# Altium schematic sheet Ethernet_Jack.SchDoc: Ethernet Jack
size A; Revision: 1
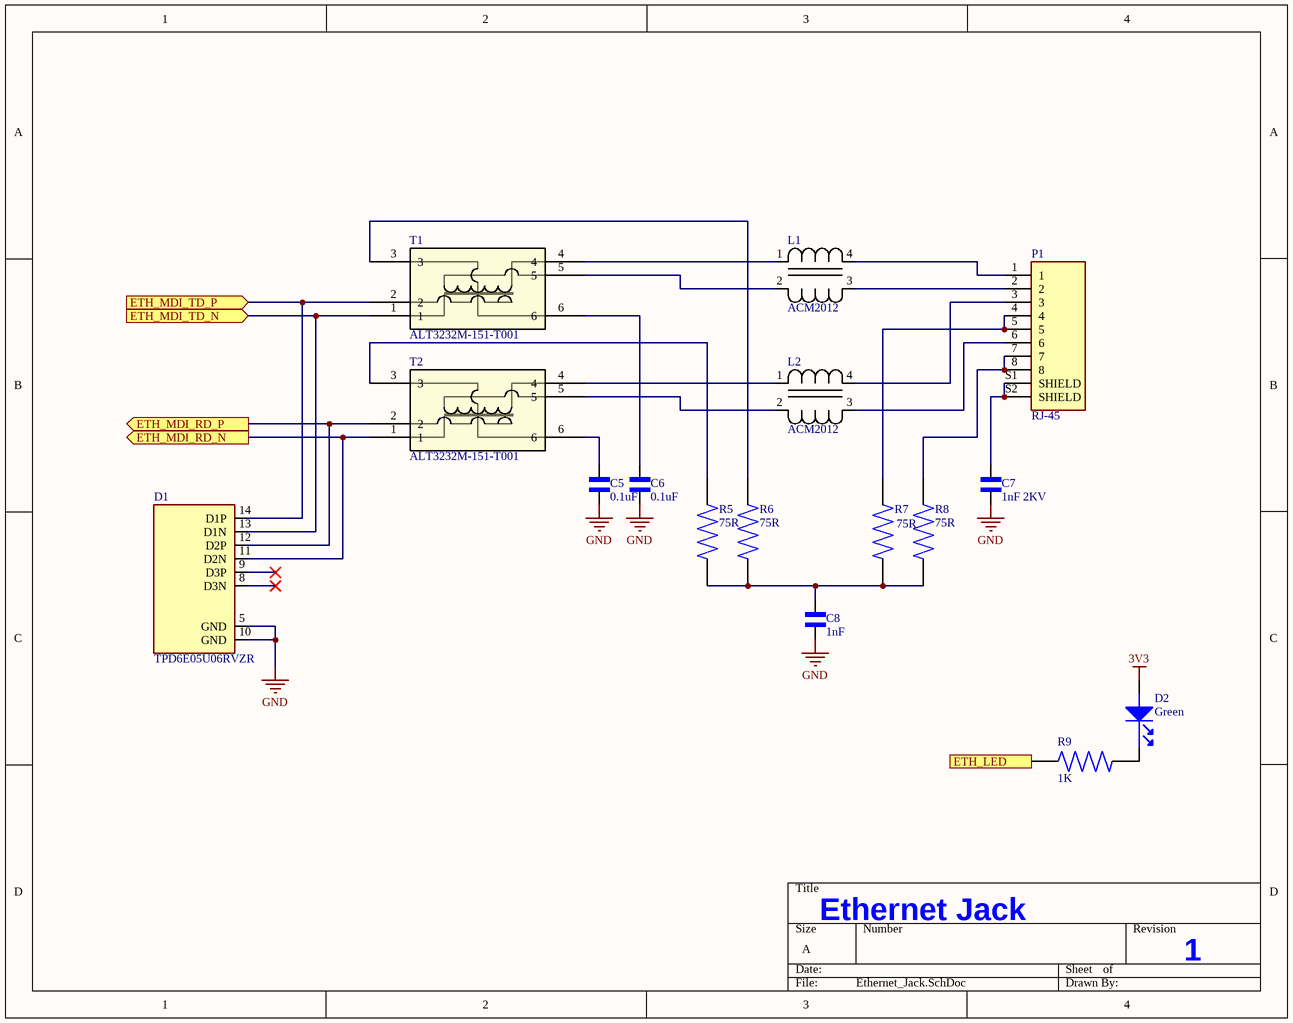
[diagram p0: Ethernet_Jack.SchDoc]

## Parts
C5  0.1uF  [C0402]
C6  0.1uF  [C0402]
C7  1nF 2KV  [RESC1206X70N]
C8  1nF  [C0402]
D1  TPD6E05U06RVZR  [SON50P135X350X55-14N]
D2  Green  [LED_0603]
L1  ACM2012  [IND_TDK_ACM2012_2P_TDK-M]
L2  ACM2012  [IND_TDK_ACM2012_2P_TDK-M]
P1  RJ-45  [TE_1-406541-5]
R5  75R  [R0402 Vishay]
R6  75R  [R0402 Vishay]
R7  75R  [R0402 Vishay]
R8  75R  [R0402 Vishay]
R9  1K  [R0603 Vishay]
T1  ALT3232M-151-T001  [ALT3232M-151-T001]
T2  ALT3232M-151-T001  [ALT3232M-151-T001]

## Ports
ETH_LED (in), ETH_MDI_RD_N (out), ETH_MDI_RD_P (out), ETH_MDI_TD_N (in), ETH_MDI_TD_P (in)

## Nets
3V3: D2.1(Anode)
GND: C5.1 C6.1 C7.1 C8.1 D1.5(GND) D1.10(GND)
ETH_LED: R9.1 ; port ETH_LED
ETH_MDI_RD_N: D1.11(D2N) T2.1 ; port ETH_MDI_RD_N
ETH_MDI_RD_P: D1.12(D2P) T2.2 ; port ETH_MDI_RD_P
ETH_MDI_TD_N: D1.13(D1N) T1.1 ; port ETH_MDI_TD_N
ETH_MDI_TD_P: D1.14(D1P) T1.2 ; port ETH_MDI_TD_P
NetC5_2: C5.2 T2.6
NetC6_2: C6.2 T1.6
NetC7_2: C7.2 P1.S1(SHIELD) P1.S2(SHIELD)
NetC8_2: C8.2 R5.1 R6.1 R7.1 R8.1
NetD2_2: D2.2(Cathode) R9.2
NetL1_1: L1.1 T1.4
NetL1_2: L1.2 T1.5
NetL1_3: L1.3 P1.2
NetL1_4: L1.4 P1.1
NetL2_1: L2.1 T2.4
NetL2_2: L2.2 T2.5
NetL2_3: L2.3 P1.6
NetL2_4: L2.4 P1.3
NetP1_4: P1.4 P1.5 R7.2
NetP1_7: P1.7 P1.8 R8.2
NetR5_2: R5.2 T2.3
NetR6_2: R6.2 T1.3

Not connected (* = marked no-connect by the designer): D1 8(D3N)* 9(D3P)*

## Library data of the parts
C5 C6 = GRM022R60J104KE15L: CAP CER 0.1UF 6.3V X5R 01005; Manufacturer: Murata; Capacitance: 100nF; Tolerance: 10%; Supplier 1: Digi-Key; Manufacturer Part Number: GRM022R60J104KE15L; RoHS: No; Category: Ceramic Capacitors; Stock 1: 633064; Pricing 1: 1=0.13000, 10=0.09000, 50=0.05080, 100=0.04210, 500=0.02952, 1000=0.02444, 2500=0.02275, 5000=0.02081 (USD); Mount: Surface Mount; Case Code (Imperial): 1005; Case Code (Metric): 0402; Min Operating Temperature: -55°C; Max Operating Temperature: 85°C; Packaging: Cut Tape; Voltage Rating: 6.3V; ComponentLink1URL: http://search.murata.co.jp/Ceramy/image/img/A01X/G101/ENG/GRM022R60J104KE15-01.pdf?src-supplier=Digi-Key; ComponentLink1Description: http://search.murata.co.jp/Ceramy/image/img/A01X/G101/ENG/GRM022R60J104KE15-01.pdf?src-supplier=Digi-Key; Supplier Part Number 1: 490-16598-1-ND
C7 = 1206GC102KAT3A: 1206 1000 pF 2000 V ±10 % Tolerance X7R SMT Multilayer Ceramic Capacitor; Manufacturer: Kyocera AVX; Tolerance: 10%; Supplier 1: Mouser; Manufacturer Part Number: 1206GC102KAT3A; RoHS: Yes; Category: Ceramic Capacitors; Stock 1: 40204; Pricing 1: 1=0.37000, 10=0.27700, 100=0.16600, 500=0.12500, 1000=0.10800, 2500=0.08900 (USD); Mount: Surface Mount; Case/Package: 1206; Case Code (Imperial): 1206; Case Code (Metric): 3216; Min Operating Temperature: -55°C; Max Operating Temperature: 125°C; Capacitance: 1nF; Packaging: Tape and Reel; Package Quantity: 10000; Voltage Rating: 2kV; Dielectric: X7R; Voltage Rating (DC): 2kV; Termination: SMD/SMT; Length: 3.2mm; Depth: 1.6mm; ComponentLink1URL: https://datasheet.ciiva.com/13205/aphvc-13205007.pdf?src-supplier=Mouser; ComponentLink1Description: https://datasheet.ciiva.com/13205/aphvc-13205007.pdf?src-supplier=Mouser; Supplier Part Number 1: 581-1206GC102KAT3A
C8 = GRM155R60J102KA01D: 0402 1 nF 6.3 V ±10% Tolerance X5R SMT Multilayer Ceramic Capacitor; Manufacturer: Murata; Voltage Rating: 6.3V; Supplier 1: Digi-Key; Manufacturer Part Number: GRM155R60J102KA01D; RoHS: Yes; Category: Ceramic Capacitors; Stock 1: 20431; Pricing 1: 1=0.10000, 10=0.02800, 50=0.01520, 100=0.01240, 500=0.00886, 1000=0.00696, 2500=0.00632, 5000=0.00582 (USD); Mount: Surface Mount; Case/Package: 0402; Case Code (Metric): 1005; Case Code (Imperial): 0402; Min Operating Temperature: -55°C; Max Operating Temperature: 85°C; Package Quantity: 10000; Capacitance: 1nF; Tolerance: 10%; Packaging: Tape and Reel; Voltage Rating (DC): 6.3V; Dielectric: X5R; Termination: SMD/SMT; Voltage: 6.3V; Length: 1mm; Width: 0.02inch; Height: 0.5mm; Thickness: 0.022inch; Depth: 0.5mm; Radiation Hardening: No; Lead Free: Lead Free; ComponentLink1URL: https://datasheet.ciiva.com/6263/product-6263681.pdf?src-supplier=Digi-Key; ComponentLink1Description: https://datasheet.ciiva.com/6263/product-6263681.pdf?src-supplier=Digi-Key; ComponentLink2URL: https://datasheet.ciiva.com/6263/partnumbering-e-01-6263685.pdf?src-supplier=Digi-Key; ComponentLink2Description: https://datasheet.ciiva.com/6263/partnumbering-e-01-6263685.pdf?src-supplier=Digi-Key; ComponentLink3URL: https://datasheet.ciiva.com/6263/partnumbering-e-01-6263677.pdf?src-supplier=Digi-Key; ComponentLink3Description: https://datasheet.ciiva.com/6263/partnumbering-e-01-6263677.pdf?src-supplier=Digi-Key; Supplier Part Number 1: 490-6285-1-ND
D1 = TPD6E05U06RVZR: TVS DIODE 5.5V 14V 14USON (ESD Protection for PHY); Manufacturer: Texas Instruments; Peak Pulse Current: 2.5A; Number of Bidirectional Channels: 6; Min Breakdown Voltage: 6V; Peak Pulse Power: 40W; Power Line Protection: Yes; Polarity: Bidirectional; Leakage Current: 10nA; Interface: LVDS,USB,Ethernet,HDMI,PCIe,SATA; Direction: Unidirectional; Supplier 1: Digi-Key; Manufacturer Part Number: TPD6E05U06RVZR; RoHS: Yes; Category: ESD and Circuit Protection ICs; Stock 1: 12287; Pricing 1: 1=0.80000, 10=0.66000, 100=0.47930, 500=0.38340, 1000=0.30885 (USD); Mount: Surface Mount; Number of Pins: 14; Min Operating Temperature: -40°C; Max Operating Temperature: 125°C; Packaging: Tape and Reel; Package Quantity: 3000; Reverse Standoff Voltage: 5.5V; Clamping Voltage: 14V; Number of Channels: 6; Breakdown Voltage: 6V; Termination: SMD/SMT; Max Power Dissipation: 40W; Working Voltage: 5.5V; Length: 3.6mm; Depth: 1.45mm; Radiation Hardening: No; Lead Free: Lead Free; ComponentLink1URL: https://datasheet.ciiva.com/29883/tpd6e05u06-29883847.pdf?src-supplier=Avnet; ComponentLink1Description: https://datasheet.ciiva.com/29883/tpd6e05u06-29883847.pdf?src-supplier=Avnet; ComponentLink2URL: https://datasheet.ciiva.com/26918/getdatasheetpartid-747210-26918045.pdf?src-supplier=Verical; ComponentLink2Description: https://datasheet.ciiva.com/26918/getdatasheetpartid-747210-26918045.pdf?src-supplier=Verical; Supplier Part Number 1: 296-39349-1-ND
D2 = LGL29K-G2J1-24-Z: LED Uni-Color Green 572nm 2-Pin Chip 0603(1608Metric) T/R; Manufacturer: Osram Opto; Lens Color: White; Forward Current: 20mA; Forward Voltage: 2.2V; Luminous Intensity: 5.6mcd; Viewing Angle: 160°; Number of LEDs: 1; Lens Style: Flat,Diffused,Colorless,Rectangular; Lens Transparency: Diffused; Reverse Voltage: 12V; Test Current: 2mA; Dominant Wavelength: 570nm; Luminous Flux: 0.012lm; Lens Size: 0.8mm; Supplier 1: Digi-Key; Manufacturer Part Number: LGL29K-G2J1-24-Z; RoHS: Yes; Category: Uncategorized; Stock 1: 112400; Pricing 1: 1=0.42000, 10=0.30400, 100=0.19830, 500=0.14250, 1000=0.11153, 2500=0.10224 (USD); Mount: Surface Mount; Case/Package: 0603; Number of Pins: 2; Case Code (Imperial): 0603; Case Code (Metric): 1608; Color: Green; Min Operating Temperature: -40°C; Max Operating Temperature: 100°C; Illumination Color: Green; Packaging: Tape and Reel; Package Quantity: 5000; Number of Elements: 1; Length: 1.3mm; Height: 0.65mm; Width: 0.8mm; Depth: 0.8mm; Radiation Hardening: No; ComponentLink1URL: https://datasheet.ciiva.com/4689/g-l29k-39844-4689584.pdf?src-supplier=Mouser; ComponentLink1Description: https://datasheet.ciiva.com/4689/g-l29k-39844-4689584.pdf?src-supplier=Mouser; ComponentLink2URL: https://datasheet.ciiva.com/15198/getdatasheetpartid-571127-15198411.pdf?src-supplier=Verical; ComponentLink2Description: https://datasheet.ciiva.com/15198/getdatasheetpartid-571127-15198411.pdf?src-supplier=Verical; ComponentLink3URL: https://datasheet.ciiva.com/2112/00077107-0-2112886.pdf?src-supplier=Digi-Key; ComponentLink3Description: https://datasheet.ciiva.com/2112/00077107-0-2112886.pdf?src-supplier=Digi-Key; ComponentLink4URL: https://datasheet.ciiva.com/2112/00077107-0-2112887.pdf?src-supplier=Digi-Key; ComponentLink4Description: https://datasheet.ciiva.com/2112/00077107-0-2112887.pdf?src-supplier=Digi-Key; ComponentLink5URL: https://datasheet.ciiva.com/2112/00077107-0-2112888.pdf?src-supplier=Digi-Key; ComponentLink5Description: https://datasheet.ciiva.com/2112/00077107-0-2112888.pdf?src-supplier=Digi-Key; Supplier Part Number 1: 475-2709-1-ND
L1 L2 = ACM2012-121-2P-T002: TDK - ACM2012-121-2P-T002 - Filter, Common Mode, ACM Series, 120 ohm, 370 mA, 2mm x 1.2mm x 1.3mm; Impedance: 120R; Voltage Rating: 50V; Number of Lines: 2; Current Rating: 370mA; DC Resistance (DCR): 220mR; Test Frequency: 100MHz; Shielding: Shielded; Supplier 1: Digi-Key; Manufacturer: TDK; Manufacturer Part Number: ACM2012-121-2P-T002; RoHS: Yes; Category: Common Mode Chokes; Stock 1: 21794; Pricing 1: 1=0.45000, 10=0.39200, 25=0.36400, 50=0.30800, 100=0.28000, 250=0.26320, 500=0.23520, 1000=0.19040 (USD); Mount: Surface Mount; Case/Package: 0805; Min Operating Temperature: -40°C; Max Operating Temperature: 85°C; Package Quantity: 1; Packaging: Tape and Reel; Voltage Rating (DC): 50V; Max DC Current: 370mA; Termination: SMD/SMT; Current: 370mA; Length: 2mm; Width: 1.2mm; Height: 1.3mm; Depth: 1.2mm; REACH SVHC: No SVHC; Lead Free: Lead Free; ComponentLink1URL: https://datasheet.ciiva.com/26793/acm2012-121-2p-t002-26793322.pdf?src-supplier=IIIC; ComponentLink1Description: https://datasheet.ciiva.com/26793/acm2012-121-2p-t002-26793322.pdf?src-supplier=IIIC; ComponentLink2URL: https://datasheet.ciiva.com/1007/e9712-acm-1007629.pdf?src-supplier=Digi-Key; ComponentLink2Description: https://datasheet.ciiva.com/1007/e9712-acm-1007629.pdf?src-supplier=Digi-Key; ComponentLink3URL: https://datasheet.ciiva.com/1007/e9712-acm-1007630.pdf?src-supplier=Digi-Key; ComponentLink3Description: https://datasheet.ciiva.com/1007/e9712-acm-1007630.pdf?src-supplier=Digi-Key; ComponentLink4URL: https://datasheet.ciiva.com/1007/e9712-acm-1007631.pdf?src-supplier=Digi-Key; ComponentLink4Description: https://datasheet.ciiva.com/1007/e9712-acm-1007631.pdf?src-supplier=Digi-Key; ComponentLink5URL: https://datasheet.ciiva.com/16416/e9719-acm2012-16416519.pdf?src-supplier=Future+Electronics; ComponentLink5Description: https://datasheet.ciiva.com/16416/e9719-acm2012-16416519.pdf?src-supplier=Future+Electronics; ComponentLink6URL: https://datasheet.ciiva.com/46450/1750020-46450935.pdf?src-supplier=Element14; ComponentLink6Description: https://datasheet.ciiva.com/46450/1750020-46450935.pdf?src-supplier=Element14; Supplier Part Number 1: 445-2208-1-ND
P1 = 1-406541-5: Conn RJ-45 F 8 POS 2.04mm Solder RA Thru-Hole 8 Terminal 1 Port Tray Cat 5; Manufacturer: TE Connectivity; Keyed: No; Element Configuration: Single; Shielding: Shielded; Max Voltage Rating (AC): 150V; Number of Ports: 1; Number of Positions: 8; PCB Mounting Orientation: Right Angle; Connector Type: Jack; Gender: Female; Direction: Up; Tail Length: 2.54mm; PCB Thickness: 1.57mm; Supplier 1: Digi-Key; Manufacturer Part Number: 1-406541-5; RoHS: Yes; Category: Modular / Ethernet Connectors; Stock 1: 2926; Pricing 1: 1=2.85000, 10=2.73200, 25=2.50440, 50=2.39040, 100=2.27660, 250=1.99208, 500=1.93514, 1000=1.65056, 2500=1.53673 (USD); Mount: Panel; Housing Material: Thermoplastic; Contact Plating: Gold; Contact Material: Bronze; Housing Color: Black; Min Operating Temperature: -40°C; Max Operating Temperature: 80°C; Termination: Solder; Orientation: Right Angle; Packaging: Tray; Package Quantity: 441; Number of Positions Loaded: 8; Number of Contacts: 8; Number of Rows: 1; Length: 17.27mm; Pitch: 2.04mm; Depth: 15.75mm; Radiation Hardening: No; Flammability Rating: UL94 V-0; REACH SVHC: Unknown; ComponentLink1URL: https://datasheet.ciiva.com/30494/0900766b8121d3cc-30494417.pdf?src-supplier=RSComponents; ComponentLink1Description: https://datasheet.ciiva.com/30494/0900766b8121d3cc-30494417.pdf?src-supplier=RSComponents; ComponentLink2URL: https://datasheet.ciiva.com/1107/1652951-1107156.pdf?src-supplier=Element14; ComponentLink2Description: https://datasheet.ciiva.com/1107/1652951-1107156.pdf?src-supplier=Element14; ComponentLink3URL: https://datasheet.ciiva.com/16324/eng-cd-406541-m8-16324678.pdf?src-supplier=Future+Electronics; ComponentLink3Description: https://datasheet.ciiva.com/16324/eng-cd-406541-m8-16324678.pdf?src-supplier=Future+Electronics; ComponentLink4URL: https://datasheet.ciiva.com/23759/1509418-23759355.pdf?src-supplier=Newark; ComponentLink4Description: https://datasheet.ciiva.com/23759/1509418-23759355.pdf?src-supplier=Newark; ComponentLink5URL: https://datasheet.ciiva.com/16548/eng-cd-406541-j-16548134.pdf?src-supplier=Avnet+Europe; ComponentLink5Description: https://datasheet.ciiva.com/16548/eng-cd-406541-j-16548134.pdf?src-supplier=Avnet+Europe; ComponentLink6URL: https://datasheet.ciiva.com/26824/getdatasheetpartid-242299-26824299.pdf?src-supplier=Verical; ComponentLink6Description: https://datasheet.ciiva.com/26824/getdatasheetpartid-242299-26824299.pdf?src-supplier=Verical; Supplier Part Number 1: A102038-ND
R5-R8 = CRCW040275R0FKED: VISHAY         CRCW040275R0FKED.            Surface Mount Chip Resistor, Thick Film, AEC-Q200 CRCW Series, 75 ohm, 63 mW,  1%, 50 V; Power Rating: 63mW; Temperature Coefficient: 100ppm/°C; Voltage Rating: 50V; Supplier 1: Digi-Key; Manufacturer: Vishay; Manufacturer Part Number: CRCW040275R0FKED; RoHS: Yes; Category: Chip SMD Resistors; Stock 1: 3085; Pricing 1: 1=0.10000, 10=0.03300, 100=0.01330, 1000=0.00596, 2500=0.00518, 5000=0.00428 (USD); Case/Package: 0402; Contact Plating: Tin; Weight: 2.3E-05oz; Case Code (Imperial): 0402; Case Code (Metric): 1005; Min Operating Temperature: -55°C; Max Operating Temperature: 155°C; Resistance: 75R; Tolerance: 1%; Resistor Type: Thick Film; Termination: SMD/SMT; Packaging: Tape and Reel; Package Quantity: 10; Number of Terminations: 2; Max Power Dissipation: 63mW; Voltage Rating (DC): 50V; Working Voltage: 50V; Features: Automotive AEC-Q200; Length: 1mm; Width: 0.5mm; Height: 0.35mm; Depth: 0.5mm; Radiation Hardening: No; Lead Free: Lead Free; REACH SVHC: Unknown; Military Standard: Not; ComponentLink1URL: https://datasheet.ciiva.com/11811/0900766b80d98824-11811348.pdf?src-supplier=RSComponents; ComponentLink1Description: https://datasheet.ciiva.com/11811/0900766b80d98824-11811348.pdf?src-supplier=RSComponents; ComponentLink2URL: https://datasheet.ciiva.com/2463/dcrcwe3-2463217.pdf?src-supplier=Digi-Key; ComponentLink2Description: https://datasheet.ciiva.com/2463/dcrcwe3-2463217.pdf?src-supplier=Digi-Key; ComponentLink3URL: https://datasheet.ciiva.com/2463/dcrcwe3-2463218.pdf?src-supplier=Digi-Key; ComponentLink3Description: https://datasheet.ciiva.com/2463/dcrcwe3-2463218.pdf?src-supplier=Digi-Key; ComponentLink4URL: https://datasheet.ciiva.com/2463/dcrcwe3-2463219.pdf?src-supplier=Digi-Key; ComponentLink4Description: https://datasheet.ciiva.com/2463/dcrcwe3-2463219.pdf?src-supplier=Digi-Key; ComponentLink5URL: https://datasheet.ciiva.com/16779/70201119-16779527.pdf?src-supplier=Allied+Electronics; ComponentLink5Description: https://datasheet.ciiva.com/16779/70201119-16779527.pdf?src-supplier=Allied+Electronics; ComponentLink6URL: https://datasheet.ciiva.com/16885/dcrcwe3-16885703.pdf?src-supplier=Avnet+Europe; ComponentLink6Description: https://datasheet.ciiva.com/16885/dcrcwe3-16885703.pdf?src-supplier=Avnet+Europe; ComponentLink7URL: https://datasheet.ciiva.com/7673/1697337-7673451.pdf?src-supplier=Element14; ComponentLink7Description: https://datasheet.ciiva.com/7673/1697337-7673451.pdf?src-supplier=Element14; ComponentLink8URL: https://datasheet.ciiva.com/7673/1697337-7673279.pdf?src-supplier=Element14; ComponentLink8Description: https://datasheet.ciiva.com/7673/1697337-7673279.pdf?src-supplier=Element14; Supplier Part Number 1: 541-75.0LCT-ND
R9 = CRCW02011K00FNED: Res Thick Film 0201 1K Ohm 1% 1/20W 200ppm/C Molded SMD SMD Paper T/R; Manufacturer: Vishay; Resistance: 1kR; Power Rating: 50mW; Voltage Rating: 30V; Temperature Coefficient: 200ppm/°C; Supplier 1: Digi-Key; Manufacturer Part Number: CRCW02011K00FNED; RoHS: Yes; Category: Chip SMD Resistors; Stock 1: 279214; Pricing 1: 1=0.10000, 10=0.05700, 100=0.02300, 1000=0.01034, 2500=0.00897, 5000=0.00741 (USD); Mount: Surface Mount; Case/Package: 0201; Number of Pins: 2; Weight: 6E-06oz; Case Code (Metric): 0603; Case Code (Imperial): 0201; Contact Plating: Tin; Min Operating Temperature: -55°C; Max Operating Temperature: 155°C; Packaging: Tape and Reel; Tolerance: 1%; Package Quantity: 1; Resistor Type: Thick Film; Number of Terminations: 2; Termination: SMD/SMT; Max Power Dissipation: 50mW; Voltage Rating (DC): 30V; Length: 0.6mm; Width: 0.012inch; Height: 0.011inch; Depth: 0.3mm; Radiation Hardening: No; REACH SVHC: Unknown; Military Standard: Not; Lead Free: Lead Free; ComponentLink1URL: https://datasheet.ciiva.com/2474/crcw0201e3-2474800.pdf?src-supplier=Digi-Key; ComponentLink1Description: https://datasheet.ciiva.com/2474/crcw0201e3-2474800.pdf?src-supplier=Digi-Key; ComponentLink2URL: https://datasheet.ciiva.com/2474/crcw0201e3-2474802.pdf?src-supplier=Digi-Key; ComponentLink2Description: https://datasheet.ciiva.com/2474/crcw0201e3-2474802.pdf?src-supplier=Digi-Key; ComponentLink3URL: https://datasheet.ciiva.com/22665/1825492-22665818.pdf?src-supplier=Element14; ComponentLink3Description: https://datasheet.ciiva.com/22665/1825492-22665818.pdf?src-supplier=Element14; ComponentLink4URL: https://datasheet.ciiva.com/7983/1719906-7983323.pdf?src-supplier=Element14; ComponentLink4Description: https://datasheet.ciiva.com/7983/1719906-7983323.pdf?src-supplier=Element14; ComponentLink5URL: https://datasheet.ciiva.com/7983/1719906-7983324.pdf?src-supplier=Element14; ComponentLink5Description: https://datasheet.ciiva.com/7983/1719906-7983324.pdf?src-supplier=Element14; ComponentLink6URL: https://datasheet.ciiva.com/2474/crcw0201e3-2474801.pdf?src-supplier=Digi-Key; ComponentLink6Description: https://datasheet.ciiva.com/2474/crcw0201e3-2474801.pdf?src-supplier=Digi-Key; ComponentLink7URL: https://datasheet.ciiva.com/3255/crcw0201e3-3255929.pdf?src-supplier=Avnet; ComponentLink7Description: https://datasheet.ciiva.com/3255/crcw0201e3-3255929.pdf?src-supplier=Avnet; ComponentLink8URL: https://datasheet.ciiva.com/22871/70202042-22871422.pdf?src-supplier=Allied+Electronics; ComponentLink8Description: https://datasheet.ciiva.com/22871/70202042-22871422.pdf?src-supplier=Allied+Electronics; ComponentLink9URL: https://datasheet.ciiva.com/22692/1719906-22692751.pdf?src-supplier=Element14; ComponentLink9Description: https://datasheet.ciiva.com/22692/1719906-22692751.pdf?src-supplier=Element14; Supplier Part Number 1: 541-1.00KABCT-ND
T1 T2 = ALT3232M-151-T001: t600,601; Built_By: EMA_Matt; Vendor: TDK; SourceLibrary: Add_to_database_2020-10-23; Type: DEV; Datasheet: https://product.tdk.com/info/en/catalog/datasheets/090007/trans_alt_en.pdf; Copyright: Copyright (C) 2018 Accelerated Designs. All rights reserved; Manufacturer_Part_Number: ALT3232M-151-T001; RefDes: RefDes